# Altium schematic sheet project_3.SchDoc
size A4; SheetNumber: 1; SheetTotal: 1
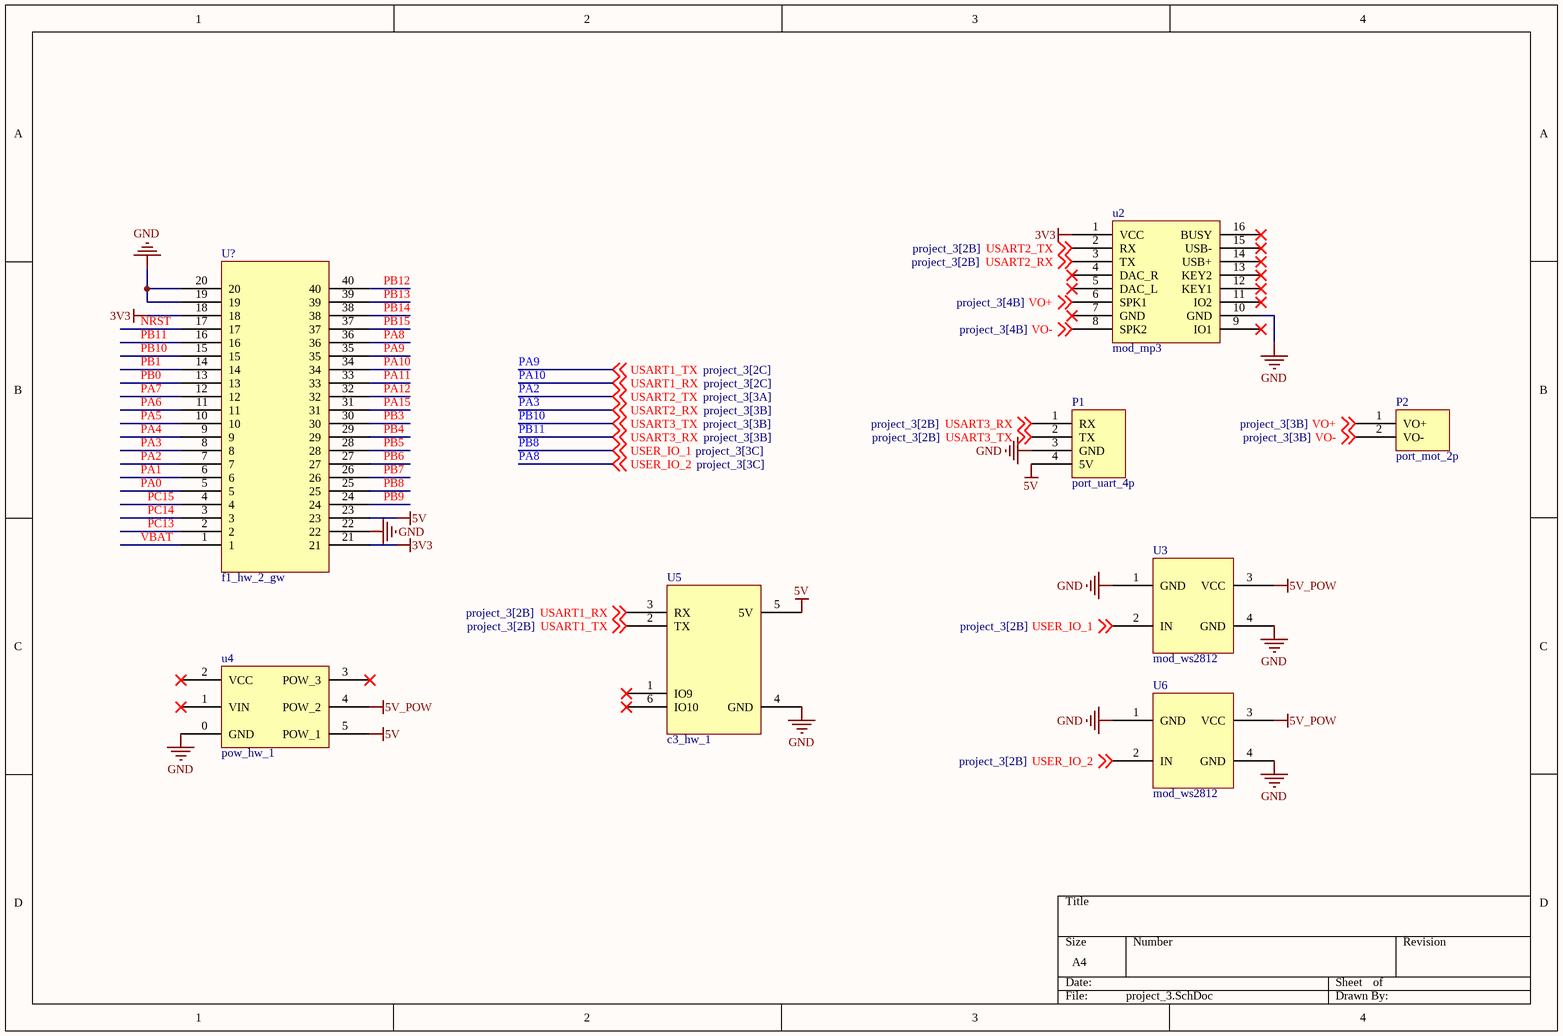
[diagram p0: project_3.SchDoc]

## Parts
P1  port_uart_4p  [XH2.54_4P]
P2  port_mot_2p  [XH2.54_2P]
u2  mod_mp3  [MOD_MP3]
U3  mod_ws2812  [MOD_WS2812]
u4  pow_hw_1  [pow_hw_1]
U5  c3_hw_1  [C3_HW_1]
U6  mod_ws2812  [MOD_WS2812]
U?  f1_hw_2_gw  [F1_HW_2_GW]

## Nets
3V3: u2.1(VCC) U?.18 U?.21
5V: P1.4(5V) u4.5(POW_1) U5.5(5V) U?.23
5V_POW: U3.3(VCC) u4.4(POW_2) U6.3(VCC)
GND: P1.3(GND) u2.10(GND) U3.1(GND) U3.4(GND) u4.0(GND) U5.4(GND) U6.1(GND) U6.4(GND) U?.19 U?.20 U?.22
NRST: U?.17
PA0: U?.5
PA1: U?.6
PA2: u2.2(RX) U?.7 ; off-sheet USART2_TX  [also labelled USART2_TX]
PA3: u2.3(TX) U?.8 ; off-sheet USART2_RX  [also labelled USART2_RX]
PA4: U?.9
PA5: U?.10
PA6: U?.11
PA7: U?.12
PA8: U6.2(IN) U?.36 ; off-sheet USER_IO_2  [also labelled USER_IO_2]
PA9: U5.2(TX) U?.35 ; off-sheet USART1_TX  [also labelled USART1_TX]
PA10: U5.3(RX) U?.34 ; off-sheet USART1_RX  [also labelled USART1_RX]
PA11: U?.33
PA12: U?.32
PA15: U?.31
PB0: U?.13
PB1: U?.14
PB3: U?.30
PB4: U?.29
PB5: U?.28
PB6: U?.27
PB7: U?.26
PB8: U3.2(IN) U?.25 ; off-sheet USER_IO_1  [also labelled USER_IO_1]
PB9: U?.24
PB10: P1.2(TX) U?.15 ; off-sheet USART3_TX  [also labelled USART3_TX]
PB11: P1.1(RX) U?.16 ; off-sheet USART3_RX  [also labelled USART3_RX]
PB12: U?.40
PB13: U?.39
PB14: U?.38
PB15: U?.37
PC13: U?.2
PC14: U?.3
PC15: U?.4
VBAT: U?.1
VO+: P2.1(VO+) u2.6(SPK1) ; off-sheet VO+
VO-: P2.2(VO-) u2.8(SPK2) ; off-sheet VO-

Not connected (* = marked no-connect by the designer): u2 4(DAC_R)* 5(DAC_L)* 7(GND)* 9(IO1)* 11(IO2)* 12(KEY1)* 13(KEY2)* 14(USB+)* 15(USB-)* 16(BUSY)*; u4 1(VIN)* 2(VCC)* 3(POW_3)*; U5 1(IO9)* 6(IO10)*

## Library data of the parts
P1 = port_uart_4p: 串口接口/SPP蓝牙模块 / XH2.54弯排针4p/4p排母
P2 = port_mot_2p: 开环直流电机接口 / XH2.54弯排针2p
u2 = mod_mp3: MP3模块
U3 U6 = mod_ws2812: ws2812*16
u4 = pow_hw_1: 三路降压电源模块 / 6p排母*2
U5 = c3_hw_1: ESP32C3蓝牙模块 / 6p排母